# EAGLE design CircuitDiagram (EAGLE 7.1.0)
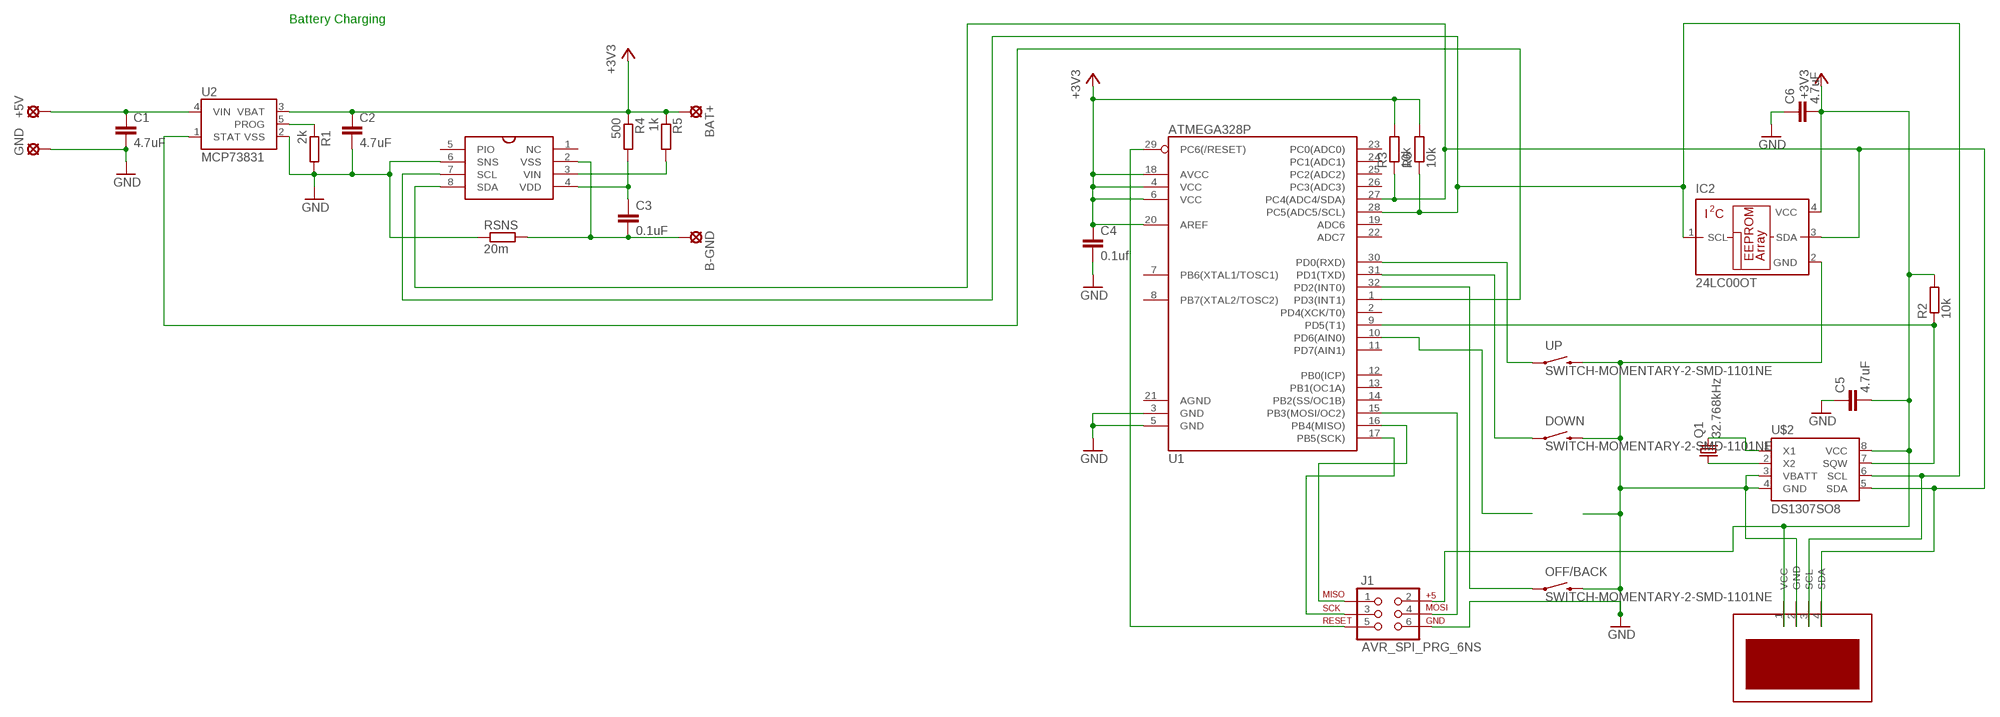
[diagram p0: schematic, sheet 1]

## Parts
+5V  LSP10  [LSP10]
B-GND  LSP10  [LSP10]
BAT+  LSP10  [LSP10]
C1  4.7uF  C-EUC0402  [C0402]
C2  4.7uF  C-EUC0402  [C0402]
C3  0.1uF  C-EUC0402  [C0402]
C4  0.1uf  C-EUC0402  [C0402]
C5  4.7uF  C-EUC0402  [C0402]
C6  4.7uF  C-EUC1005  [C1005]
DOWN  SWITCH-MOMENTARY-2-SMD-1101NE  [TACTILE-SWITCH-1101NE]
GND  LSP10  [LSP10]
IC2  24LC00OT  [SOT23-5L]
J1  AVR_SPI_PRG_6NS  [2X3-NS]
OFF/BACK  SWITCH-MOMENTARY-2-SMD-1101NE  [TACTILE-SWITCH-1101NE]
Q1  32.768kHz  CRYSTALS-NOGND-CFPX-217  [3.2X1.5-2-PAD]
R1  2k  R-EU_R0603  [R0603]
R2  10k  R-EU_R0603  [R0603]
R3  10k  R-EU_R0603  [R0603]
R4  500  R-EU_R0603  [R0603]
R5  1k  R-EU_R0603  [R0603]
R6  10k  R-EU_R0603  [R0603]
RSNS  20m  R-EU_R0603  [R0603]
U1  ATMEGA328P  ATMEGA328_SMT  [TQFP32-08]
U2  MCP73831  [SOT23-5]
U$1  DS2782-2  [TSSOP8]
U$2  DS1307SO8  [SO08]
U$3  OLED  [OLED]
UP  SWITCH-MOMENTARY-2-SMD-1101NE  [TACTILE-SWITCH-1101NE]

## Nets
5V [+5v]: +5V.MP C1.1 U2.4(VIN)
+3V3 [+3.7]: BAT+.MP C2.1 C4.1 C5.2 C6.2 IC2.4(VCC) J1.2 R2.2 R3.2 R4.1 R5.1 R6.2 U1.4(VCC) U1.6(VCC) U1.18(AVCC) U1.20(AREF) U2.3(VBAT) U$2.8(VCC) U$3.1(VCC)
GND [GND]: C1.2 C2.2 C4.2 C5.1 C6.1 DOWN.2 GND.MP IC2.2(GND) J1.6 OFF/BACK.2 R1.2 RSNS.1 U1.3(GND) U1.5(GND) U2.2(VSS) U$1.6(SNS) U$2.3(VBATT) U$2.4(GND) U$3.2(GND) UP.2
N$1: R1.1 U2.5(PROG)
N$2: IC2.1(SCL) R6.1 U1.28(PC5(ADC5/SCL)) U$1.7(SCL) U$2.6(SCL) U$3.3(SCL)
N$3: R5.2 U$1.3(VIN)
N$4: C3.1 R4.2 U$1.4(VDD)
N$5: B-GND.MP C3.2 RSNS.2 U$1.2(VSS)
N$6: IC2.3(SDA) R3.1 U1.27(PC4(ADC4/SDA)) U$1.8(SDA) U$2.5(SDA) U$3.4(SDA)
N$7: U1.1(PD3(INT1)) U2.1(STAT)
N$8: U1.30(PD0(RXD)) UP.1
N$9: DOWN.1 U1.31(PD1(TXD))
N$10: U1.10(PD6(AIN0))
N$11: OFF/BACK.1 U1.32(PD2(INT0))
N$12: Q1.2 U$2.1(X1)
N$13: Q1.1 U$2.2(X2)
N$14: R2.1 U1.9(PD5(T1)) U$2.7(SQW)
N$16: J1.1 U1.16(PB4(MISO))
N$17: J1.3 U1.17(PB5(SCK))
N$18: J1.4 U1.15(PB3(MOSI/OC2))
N$19: J1.5 U1.29(PC6(/RESET))
Unconnected: U1.2(PD4(XCK/T0)) U1.7(PB6(XTAL1/TOSC1)) U1.8(PB7(XTAL2/TOSC2)) U1.11(PD7(AIN1)) U1.12(PB0(ICP)) U1.13(PB1(OC1A)) U1.14(PB2(SS/OC1B)) U1.19(ADC6) U1.21(AGND) U1.22(ADC7) U1.23(PC0(ADC0)) U1.24(PC1(ADC1)) U1.25(PC2(ADC2)) U1.26(PC3(ADC3)) U$1.1(NC) U$1.5(PIO)

## Notes on the sheet
- Battery Charging

## Library data of the parts
+5V B-GND BAT+ GND = solpad:LSP10: SOLDER PAD drill 1.0 mm, distributor Buerklin, 12H555
C1-C6 = rcl:C-EU: CAPACITOR, European symbol
DOWN OFF/BACK UP = SparkFun-Electromechanical:SWITCH-MOMENTARY-2: Various NO switches- pushbuttons, reed, etc
IC2 = microchip:24*00: Serial EEPROM 128 bit, I2C (AA = 1.8 V/LC = 2.5 V/C = 5.0 V); MF: MICROCHIP; MPN: 24LC00T-I/OT; OC_FARNELL: 9757864; OC_NEWARK: 62K0574
J1 = SparkFun-Connectors:AVR_SPI_PRG_6: AVR ISP 6 Pin This is the reduced ISP connector for AVR programming. Common on Arduino. This footprint will take up less PCB space and can be used with a 10-pin to 6-pin adapter such as SKU: BOB-08508 **Special note about "TEST_POINT" package. The stop mask is on the top side, so if you want your programming test points to be on the bottom of your board, make sure to place this package on the bottom side of the board. This also ensure that the orientation to program from the bottom side will be correct.
Q1 = IQD-Frequency-Products:CRYSTALS-NOGND: CRYSTALS CAN NOT GROUNDED
R1-R6 RSNS = rcl:R-EU_: RESISTOR, European symbol
U1 = SparkFun-DigitalIC:ATMEGA328_SMT: 32-Pin Atmega328 part Commonly used on Arduino compatible boards Available in QFP and QFN packages TQFP is IC-09069 QFN is non-stock; PROD_ID: IC-09069
U2 = SparkFun-PowerIC:MCP73831: Miniature single cell, fully integrated Li-Ion, Li-polymer charge management controller http://ww1.microchip.com/downloads/en/DeviceDoc/21984a.pdf IC-09995; PROD_ID: IC-09995
U$1 = Library:DS2782-2
U$2 = SparkFun-FreqCtrl:DS1307: I2C real-time clock with battery backup.
U$3 = Library:OLED

## Net classes
0 default: width 0.254 mm
1 GND: width 0.1 mm
2 +5v: width 0.5 mm
3 +3.7: width 0.254 mm

## Board
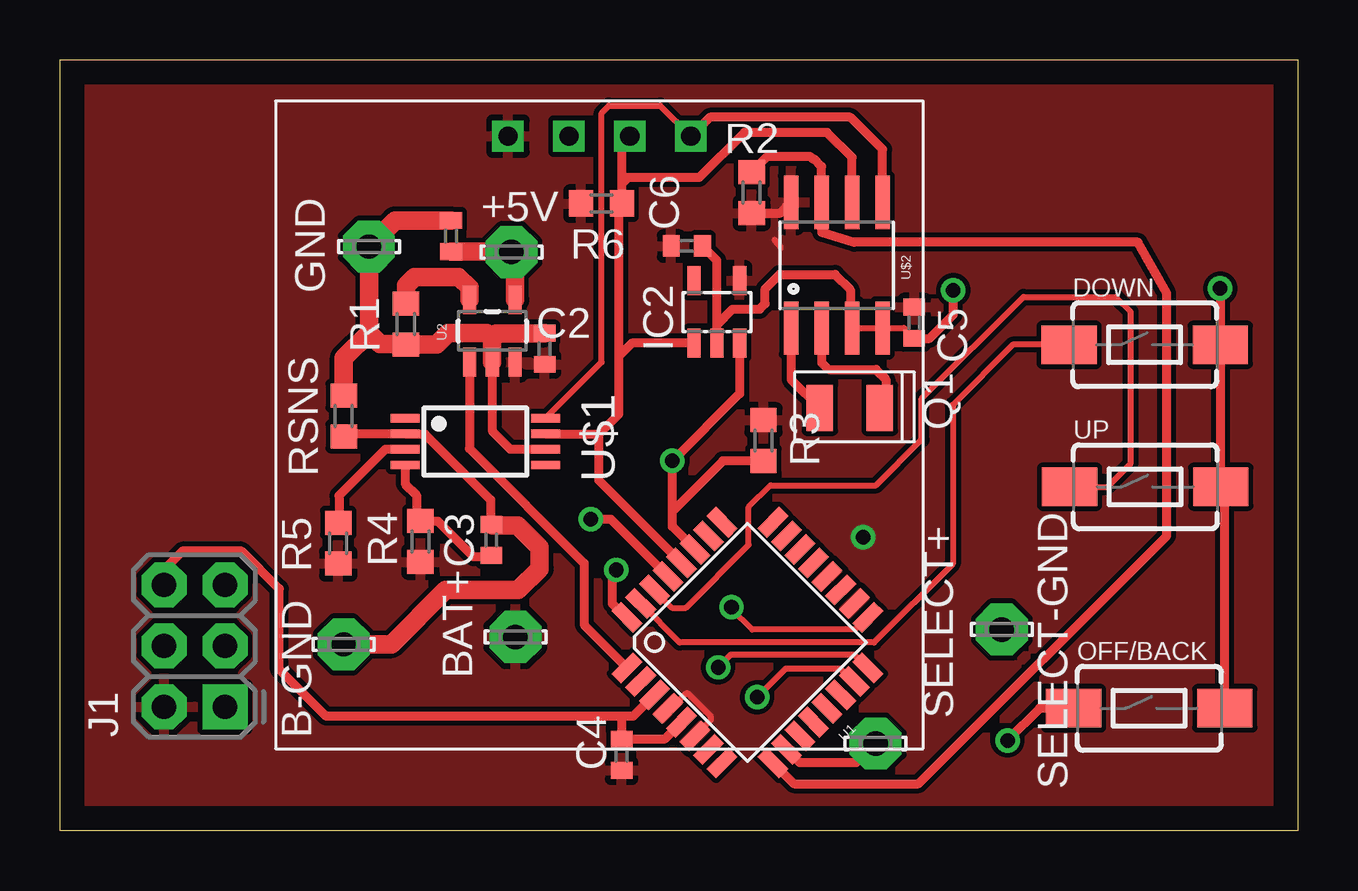
[diagram p1: board, top side]
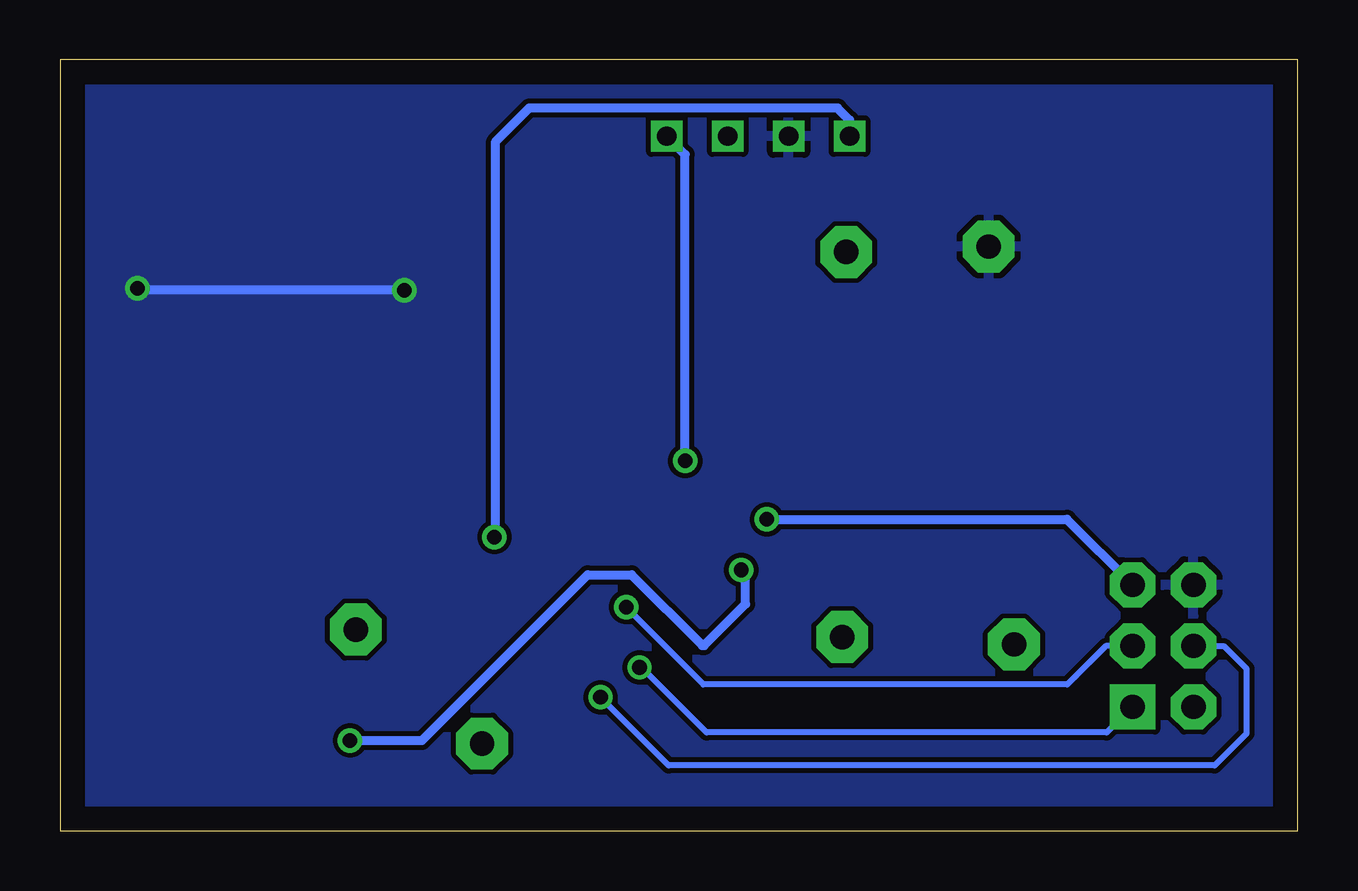
[diagram p2: board, bottom side, seen from below]

Size 51.59 x 32.13 mm. Coordinates in mm from the lower left corner, seen from the top.
Outline: 0,32.13 51.59,32.13 51.59,0 0,0 0,32.13
Copper layers (1*16): Top 0.035mm / dielectric 1.5mm / Bottom 0.035mm
Design rules "default": minimum track width 10mil, minimum drill 24mil, track to track 8mil, track to pad 8mil, pad to pad 8mil, via to via 8mil, smd to smd 8mil, copper to edge 40mil, drill to drill 8mil, minimum pad ring 10mil, minimum via ring 8mil, stop-mask expansion 4mil, vias tented up to drill 0mil, thermal gap 10mil

### Footprints (pad centres in the part's own frame; a part is rotated, then mirrored left to right if it is on the bottom)
LSP10 = drill 1.016 pad 2.159 octagon: MP 0,0
C0402 = smd 0.7 x 0.9: 1 -0.65,0; 2 0.65,0
C1005 = smd 0.7 x 0.9: 1 -0.65,0; 2 0.65,0
TACTILE-SWITCH-1101NE = smd 2.3 x 1.6: 1 -3.15,0; 2 3.15,0
SOT23-5L = smd 0.55 x 1.2: 1 -0.95,-1.3; 2 0,-1.3; 3 0.95,-1.3; 4 0.95,1.3; 5 -0.95,1.3
2X3-NS = drill 1.016 pad 1.88 square: 1 -2.54,-1.27 | drill 1.016 pad 1.88 octagon: 2 -2.54,1.27; 3 0,-1.27; 4 0,1.27; 5 2.54,-1.27; 6 2.54,1.27
3.2X1.5-2-PAD = smd 1.1 x 1.9: 1 -1.25,0; 2 1.25,0
R0603 = smd 1 x 1.1: 1 -0.85,0; 2 0.85,0
TQFP32-08 = smd 1.27 x 0.559: 1 -4.293,2.8; 2 -4.293,2; 3 -4.293,1.2; 4 -4.293,0.4; 5 -4.293,-0.4; 6 -4.293,-1.2; 7 -4.293,-2; 8 -4.293,-2.8; 17 4.293,-2.8; 18 4.293,-2; 19 4.293,-1.2; 20 4.293,-0.4; 21 4.293,0.4; 22 4.293,1.2; 23 4.293,2; 24 4.293,2.8 | smd 0.559 x 1.27: 9 -2.8,-4.293; 10 -2,-4.293; 11 -1.2,-4.293; 12 -0.4,-4.293; 13 0.4,-4.293; 14 1.2,-4.293; 15 2,-4.293; 16 2.8,-4.293; 25 2.8,4.293; 26 2,4.293; 27 1.2,4.293; 28 0.4,4.293; 29 -0.4,4.293; 30 -1.2,4.293; 31 -2,4.293; 32 -2.8,4.293
SOT23-5 = smd 0.55 x 1.2: 1 -0.95,-1.3; 2 0,-1.3; 3 0.95,-1.3; 4 0.95,1.3; 5 -0.95,1.3
TSSOP8 = smd 1.2 x 0.35: 1 -2.925,0.975; 2 -2.925,0.325; 3 -2.925,-0.325; 4 -2.925,-0.975; 5 2.925,-0.975; 6 2.925,-0.325; 7 2.925,0.325; 8 2.925,0.975
SO08 = smd 0.61 x 2.21: 1 -1.905,-2.616; 2 -0.635,-2.616; 3 0.635,-2.616; 4 1.905,-2.616; 5 1.905,2.616; 6 0.635,2.616; 7 -0.635,2.616; 8 -1.905,2.616
OLED = drill 0.8 square: 1 -3.81,2.54; 2 -1.27,2.54; 3 1.27,2.54; 4 3.81,2.54

### Placement (x,y rotation side)
+5V  18.82,24.12 0 top
B-GND  11.82,7.77 0 top
BAT+  18.98,8.07 0 top
C1  16.3,24.79 90 top
C2  20.2,20.09 90 top
C3  17.98,12.12 90 top
C4  23.41,3.16 90 top
C5  35.61,21.17 90 top
C6  26.13,24.38 180 top
DOWN  45.21,20.26 0 top
GND  12.88,24.35 0 top
IC2  27.38,21.63 0 top
J1  5.61,7.7 90 top
OFF/BACK  45.4,5.1 0 top
Q1  32.92,17.62 180 top
R1  14.42,21.12 270 top
R2  28.83,26.6 270 top
R3  29.32,16.26 90 top
R4  15.03,12.06 90 top
R5  11.6,11.99 90 top
R6  22.57,26.15 180 top
RSNS  11.83,17.29 270 top
SELECT+  LSP10  [LSP10]  34,3.63 0 top
SELECT-GND  LSP10  [LSP10]  39.26,8.39 180 top
U1  28.66,7.85 45 top
U2  18.02,20.83 0 top
U$1  17.32,16.22 0 top
U$2  32.38,23.58 0 top
U$3  22.48,26.41 0 top
UP  45.24,14.34 0 top

### Tracks (layer width: path | path; a pad name or v marks a point on that pad's centre or on a via)
5V
  Top 0.762: U2.4 18.97,23.97 +5V.MP 18.8,24.14 C1.1
+3V3  (via drill 0.61)
  Top 0.254: U1.20 31.98,10.74 | U1.6 27.13,4.62 27.13,4.77 26.19,5.71 26.09,5.71 25.46,5.09 U1.4 | 29.79,24.63 30.05,24.31
  Top 0.381: U$2.8 30.03,25.75 R2.2 28.68,25.91
  Bottom 0.381: U$3.1 18.67,29.62 19.18,30.12 32.03,30.12 33.45,28.7 33.45,12.27 v33.48,12.24
  pour Top: 0.91,31.29 50.67,31.45 50.62,0.84 0.76,0.69
GND  (via drill 0.61)
  Top 0.254: U$2.3 U$2.4 35.17,20.96 C5.1
  Top 0.381: U$1.6 18.78,15.89 18.03,16.64 18.03,19.52 U2.2 | OFF/BACK.2 48.55,14.17 UP.2 48.39,20.23 DOWN.2 v48.36,22.61 | U1.3 23.89,4.77 23.42,4.77 | 23.42,4.77 11.1,4.77 9.14,6.73 9.14,10.08 7.57,11.66 5.11,11.66 4.34,10.89 J1.6 | 23.42,4.77 23.42,3.82 C4.2 25.19,3.81 U1.5 | C5.1 36.25,20.52 37.24,21.51 v37.24,22.53 | C6.1 27.38,23.77 IC2.2 27.38,21.08 28.04,21.74 29.16,21.74 29.39,21.97 29.39,22.58 30,23.19 32.31,23.19 32.94,22.55 32.94,21.03 U$2.3
  Top 0.762: C1.2 13.97,25.44 GND.MP 12.88,20.75 | 12.88,20.75 13.33,20.29 14.4,20.29 R1.2 15.7,20.27 16.18,20.75 17.78,20.75 17.97,20.56 18.02,20.56 | RSNS.1 11.83,19.71 12.88,20.75 | U2.2 18.02,20.56 | 18.02,20.56 18.19,20.73 20.18,20.73 C2.2
  Bottom 0.381: v37.24,22.53 48.29,22.53 v48.36,22.61
  pour Bottom: 0.86,31.37 50.67,31.42 50.5,0.81 0.79,0.76
N$1
  Top 0.508: 14.58,22.13 R1.1
  Top 0.762: U2.5 17.07,22.63 16.61,23.09 14.78,23.09 14.43,22.73 R1.1
N$2
  Top 0.381: U$1.7 22.46,16.54 | 22.46,16.54 23.29,17.37 23.29,19.79 | 23.29,19.79 23.29,26.1 R6.1 23.42,26.97 | IC2.1 23.83,20.33 23.29,19.79 | 23.42,26.97 23.42,28.62 U$3.3 | U$2.6 33.01,28.07 31.98,29.11 28.52,29.11 26.64,27.23 23.68,27.23 23.42,26.97 | U1.28 22.46,14.61 22.46,16.54
N$3
  Top 0.381: U$1.3 13.56,15.89 11.63,13.97 11.63,12.87 R5.2
N$4
  Top 0.381: U$1.4 14.39,14.46 14.86,14 14.86,13.08 R4.2 15.74,12.91 17.22,11.43 17.93,11.43 C3.1
N$5
  Top 0.381: RSNS.2 11.94,16.54 U$1.2 15.21,16.54 17.96,13.79 17.96,12.79 C3.2
  Top 0.762: B-GND.MP 13.81,7.77 16.08,10.03 19.1,10.03 19.99,10.92 19.99,11.81 19.08,12.73 18.02,12.73 C3.2
N$6  (via drill 0.61)
  Top 0.254: 25.5,15.39 v25.53,15.42 | U$1.8 22.58,19.53 22.58,29.92 22.89,30.23 25.02,30.23 U$3.4
  Top 0.381: U1.27 25.53,12.67 25.53,13.31 | 25.53,13.31 v25.53,15.42 | v25.53,15.42 v25.53,15.41 | IC2.3 28.33,18.22 v25.53,15.42 | R3.1 27.63,15.41 25.53,13.31 | U$2.5 34.28,28.4 32.94,29.74 27.08,29.74 U$3.4
  Bottom 0.381: v25.53,15.42 25.53,28.19 U$3.4
N$7
  Top 0.381: U2.1 17.07,15.93 21.84,11.15 21.84,8.59 U1.1
N$8
  Top 0.254: U1.30 25.51,9.3 26.09,9.3 28.7,11.91 28.7,13.49 29.62,14.4 34.01,14.4 35.92,16.31 35.92,18.01 40.16,22.25 44.02,22.25 44.63,21.64 44.63,15.32 43.65,14.34 UP.1
N$9
  Top 0.254: DOWN.1 39.71,20.26 37.21,17.75 37.21,11.12 33.93,7.85 25.83,7.85 U1.31
N$10
  Top 0.254: 30.51,3.4 U1.10
  Top 0.381: U1.10 30.83,2.84 33.2,2.84 34.04,3.71 34.19,3.38
N$11  (via drill 0.61)
  Top 0.381: OFF/BACK.1 40.84,5.1 v39.5,3.76 | v23.19,10.87 23.01,10.69 23.01,9.47 23.59,8.9 U1.32
  Bottom 0.381: v39.5,3.76 36.5,3.76 29.59,10.67 27.76,10.67 24.82,7.72 24.74,7.72 23.01,9.45 23.01,10.69 v23.19,10.87
N$12
  Top 0.381: U$2.1 30.47,18.82 Q1.2
N$13
  Top 0.381: U$2.2 31.74,19.51 32.03,19.23 34.01,19.23 34.42,18.82 34.42,17.87 Q1.1
N$14
  Top 0.381: R2.1 29.47,28.09 31.29,28.09 31.37,28.02 31.42,28.02 31.74,27.69 U$2.7 31.74,24.95 33.1,24.54 44.93,24.54 46.13,22.4 46.13,12.29 35.79,1.96 30.59,1.96 U1.9
N$16  (via drill 0.61)
  Top 0.254: 33.47,6.79 U1.16 33.65,6.79 33.1,7.34 27.97,7.34 v27.43,6.81
  Bottom 0.254: J1.1 7.95,4.09 24.64,4.09 27.36,6.81 v27.43,6.81
N$17  (via drill 0.61)
  Top 0.254: U1.17 33.16,8.38 28.85,8.38 27.99,9.25 v27.99,9.32
  Bottom 0.254: J1.3 7.99,7.7 9.6,6.1 24.76,6.1 v27.99,9.32
N$18  (via drill 0.61)
  Top 0.254: 32.99,6.22 U1.15 33.04,6.22 32.51,6.76 30.25,6.76 v29.06,5.56
  Bottom 0.254: J1.4 3.08,7.7 2.13,6.76 2.13,4.04 3.45,2.72 26.21,2.72 v29.06,5.56
N$19  (via drill 0.61)
  Top 0.381: U1.29 22.96,12.98 v22.12,12.98
  Bottom 0.381: v22.12,12.98 9.61,12.98 J1.5